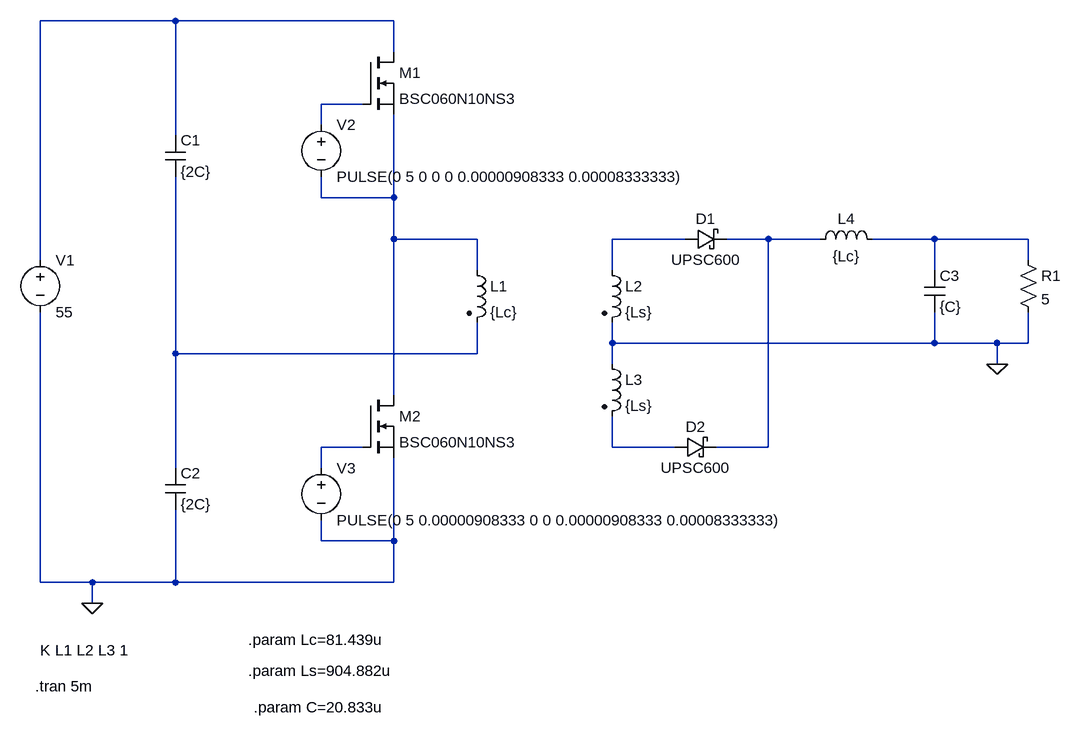
[diagram p0: schematic halfbridge_circuit.asc]
halfbridge_circuit.asc, the LTspice schematic file:
Version 4
SHEET 1 1184 684
WIRE -192 -560 -400 -560
WIRE 144 -560 -192 -560
WIRE 144 -512 144 -560
WIRE 96 -432 32 -432
WIRE 32 -400 32 -432
WIRE -192 -384 -192 -560
WIRE 32 -288 32 -320
WIRE 144 -288 144 -416
WIRE 144 -288 32 -288
WIRE 144 -224 144 -288
WIRE 272 -224 144 -224
WIRE 592 -224 480 -224
WIRE 720 -224 656 -224
WIRE 800 -224 720 -224
WIRE 976 -224 880 -224
WIRE 1120 -224 976 -224
WIRE -400 -192 -400 -560
WIRE 1120 -192 1120 -224
WIRE 272 -176 272 -224
WIRE 480 -176 480 -224
WIRE 976 -176 976 -224
WIRE 480 -64 480 -96
WIRE 976 -64 976 -112
WIRE 976 -64 480 -64
WIRE 1072 -64 976 -64
WIRE 1120 -64 1120 -112
WIRE 1120 -64 1072 -64
WIRE -192 -48 -192 -320
WIRE 272 -48 272 -96
WIRE 272 -48 -192 -48
WIRE 480 -32 480 -64
WIRE 1072 -32 1072 -64
WIRE 144 16 144 -224
WIRE 96 96 32 96
WIRE 480 96 480 48
WIRE 576 96 480 96
WIRE 720 96 720 -224
WIRE 720 96 640 96
WIRE -192 128 -192 -48
WIRE 32 128 32 96
WIRE 32 240 32 208
WIRE 144 240 144 112
WIRE 144 240 32 240
WIRE -400 304 -400 -112
WIRE -320 304 -400 304
WIRE -192 304 -192 192
WIRE -192 304 -320 304
WIRE 144 304 144 240
WIRE 144 304 -192 304
WIRE -320 336 -320 304
FLAG 1072 -32 0
FLAG -320 336 0
SYMBOL voltage -400 -208 R0
WINDOW 123 0 0 Left 0
WINDOW 39 0 0 Left 0
SYMATTR InstName V1
SYMATTR Value 55
SYMBOL res 1104 -208 R0
SYMATTR InstName R1
SYMATTR Value 5
SYMBOL voltage 32 -416 R0
WINDOW 123 0 0 Left 0
WINDOW 39 0 0 Left 0
SYMATTR InstName V2
SYMATTR Value PULSE(0 5 0 0 0 0.00000908333 0.00008333333)
SYMBOL schottky 592 -208 R270
WINDOW 0 32 32 VTop 2
WINDOW 3 0 32 VBottom 2
SYMATTR InstName D1
SYMATTR Value UPSC600
SYMATTR Description Diode
SYMATTR Type diode
SYMBOL nmos 96 -512 R0
SYMATTR InstName M1
SYMATTR Value BSC060N10NS3
SYMBOL ind2 256 -192 R0
SYMATTR InstName L1
SYMATTR Value {Lc}
SYMATTR Type ind
SYMBOL cap 960 -176 R0
SYMATTR InstName C3
SYMATTR Value {C}
SYMBOL schottky 576 112 R270
WINDOW 0 32 32 VTop 2
WINDOW 3 0 32 VBottom 2
SYMATTR InstName D2
SYMATTR Value UPSC600
SYMATTR Description Diode
SYMATTR Type diode
SYMBOL voltage 32 112 R0
WINDOW 123 0 0 Left 0
WINDOW 39 0 0 Left 0
SYMATTR InstName V3
SYMATTR Value PULSE(0 5 0.00000908333 0 0 0.00000908333 0.00008333333)
SYMBOL nmos 96 16 R0
SYMATTR InstName M2
SYMATTR Value BSC060N10NS3
SYMBOL ind 784 -208 R270
WINDOW 0 32 56 VTop 2
WINDOW 3 5 56 VBottom 2
SYMATTR InstName L4
SYMATTR Value {Lc}
SYMBOL ind2 464 -192 R0
SYMATTR InstName L2
SYMATTR Value {Ls}
SYMATTR Type ind
SYMBOL ind2 464 -48 R0
SYMATTR InstName L3
SYMATTR Value {Ls}
SYMATTR Type ind
SYMBOL cap -208 -384 R0
SYMATTR InstName C1
SYMATTR Value {2C}
SYMBOL cap -208 128 R0
SYMATTR InstName C2
SYMATTR Value {2C}
TEXT -408 464 Left 2 !.tran 5m
TEXT -400 408 Left 2 !K L1 L2 L3 1
TEXT -80 392 Left 2 !.param Lc=81.439u
TEXT -80 440 Left 2 !.param Ls=904.882u
TEXT -72 496 Left 2 !.param C=20.833u

The netlist it stands for:
* halfbridge_circuit.asc
V1 N001 0 55
R1 N006 0 5
V2 N002 N003 PULSE(0 5 0 0 0 0.00000908333 0.00008333333)
D1 N004 N005 UPSC600
M1 N001 N002 N003 N003 BSC060N10NS3
L1 N003 N007 {Lc}
C3 N006 0 {C}
D2 N009 N005 UPSC600
V3 N008 0 PULSE(0 5 0.00000908333 0 0 0.00000908333 0.00008333333)
M2 N003 N008 0 0 BSC060N10NS3
L4 N005 N006 {Lc}
L2 N004 0 {Ls}
L3 0 N009 {Ls}
C1 N001 N007 {2C}
C2 N007 0 {2C}
.model D D
.lib standard.dio
.model NMOS NMOS
.model PMOS PMOS
.lib standard.mos
.tran 5m
K L1 L2 L3 1
.param Lc=81.439u
.param Ls=904.882u
.param C=20.833u
.backanno
.end